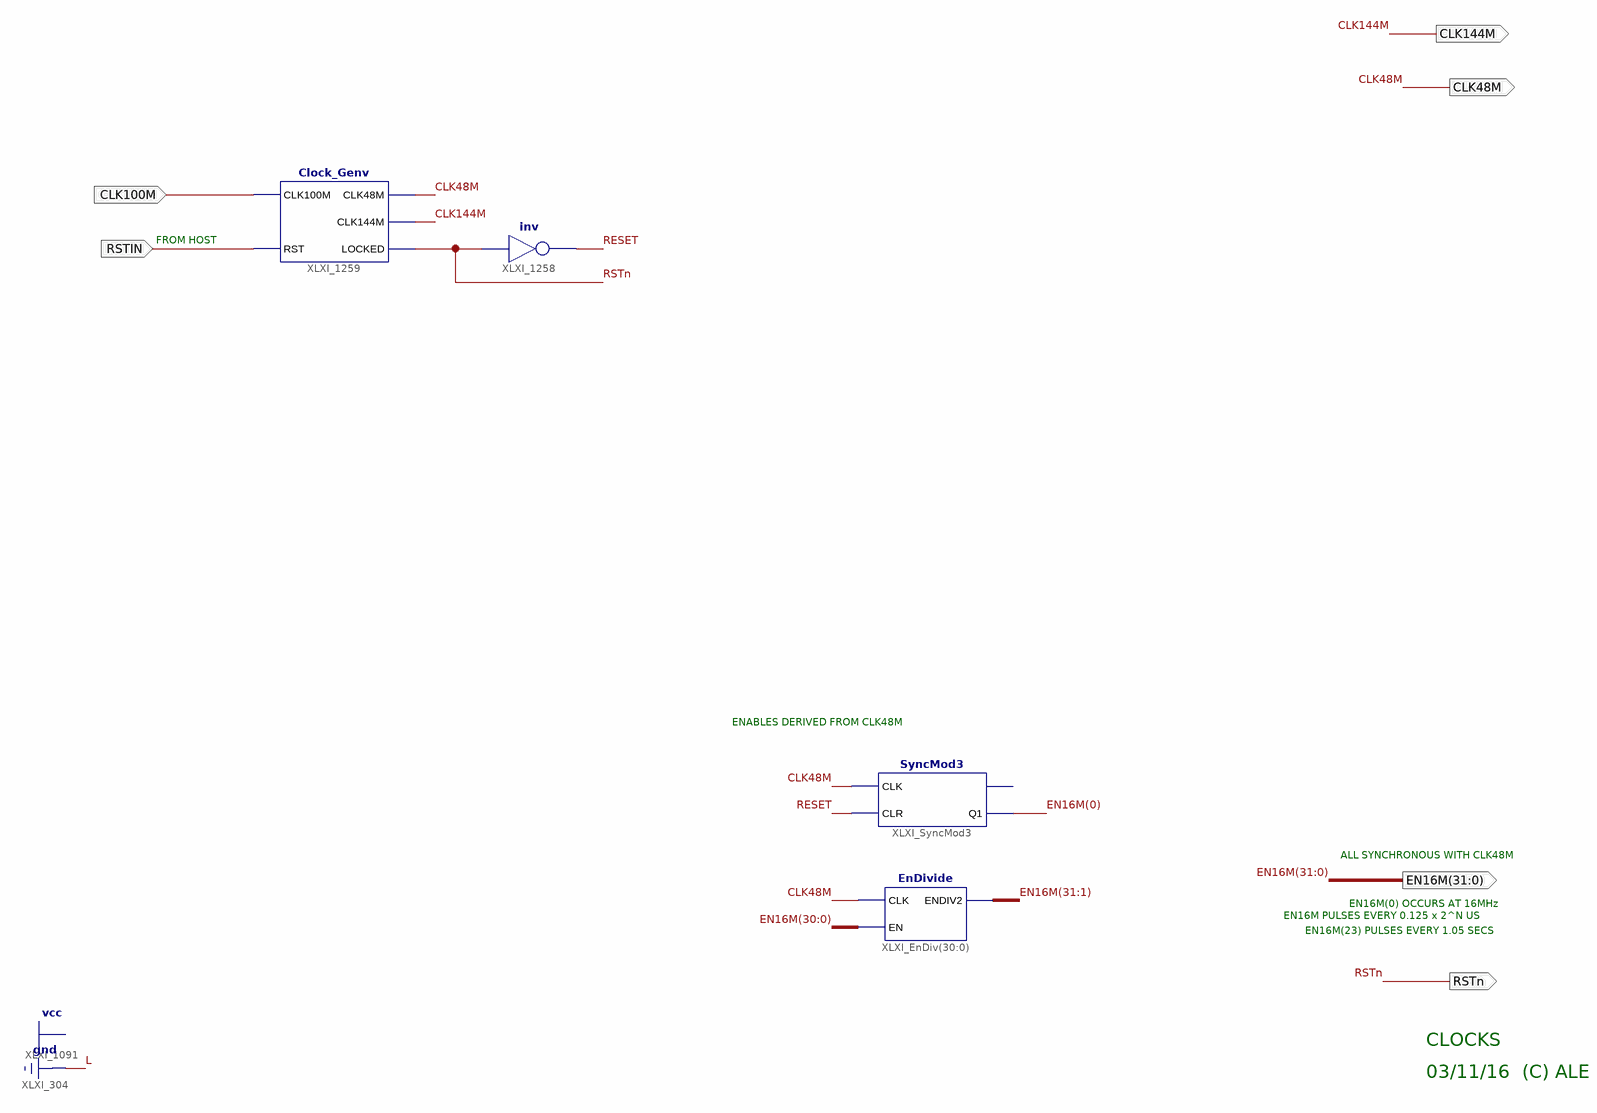
[diagram p0: schematic sheet 1]
// Xilinx ISE schematic Clocks.sch (zynq) as structural Verilog: 4 symbols, 6 ports
module Clocks (
  input  CLK100M,
  input  RSTIN,
  output RSTn,
  output CLK48M,
  output CLK144M,
  output [31:0] EN16M
);

  wire RESET;

  Clock_Genv XLXI_1259 (.CLK100M(CLK100M), .RST(RSTIN), .CLK48M(CLK48M), .CLK144M(CLK144M), .LOCKED(RSTn));
  not XLXI_1258 (RESET, RSTn);
  EnDivide XLXI_EnDiv[30:0] (.CLK(CLK48M), .EN(EN16M[30:0]), .ENDIV2(EN16M[31:1]));
  SyncMod3 XLXI_SyncMod3 (.CLK(CLK48M), .CLR(RESET), .Q1(EN16M[0]));  // open: Q0

  // Notes on the sheet:
  //   FROM HOST
  //   ENABLES DERIVED FROM CLK48M
  //   ALL SYNCHRONOUS WITH CLK48M
  //   EN16M(0) OCCURS AT 16MHz
  //   EN16M PULSES EVERY 0.125 x 2^N US
  //   EN16M(23) PULSES EVERY 1.05 SECS
  //   CLOCKS
  //   03/11/16  (C) ALE
endmodule
